# Altium schematic sheet SolderingStation_Power.SchDoc
size A4
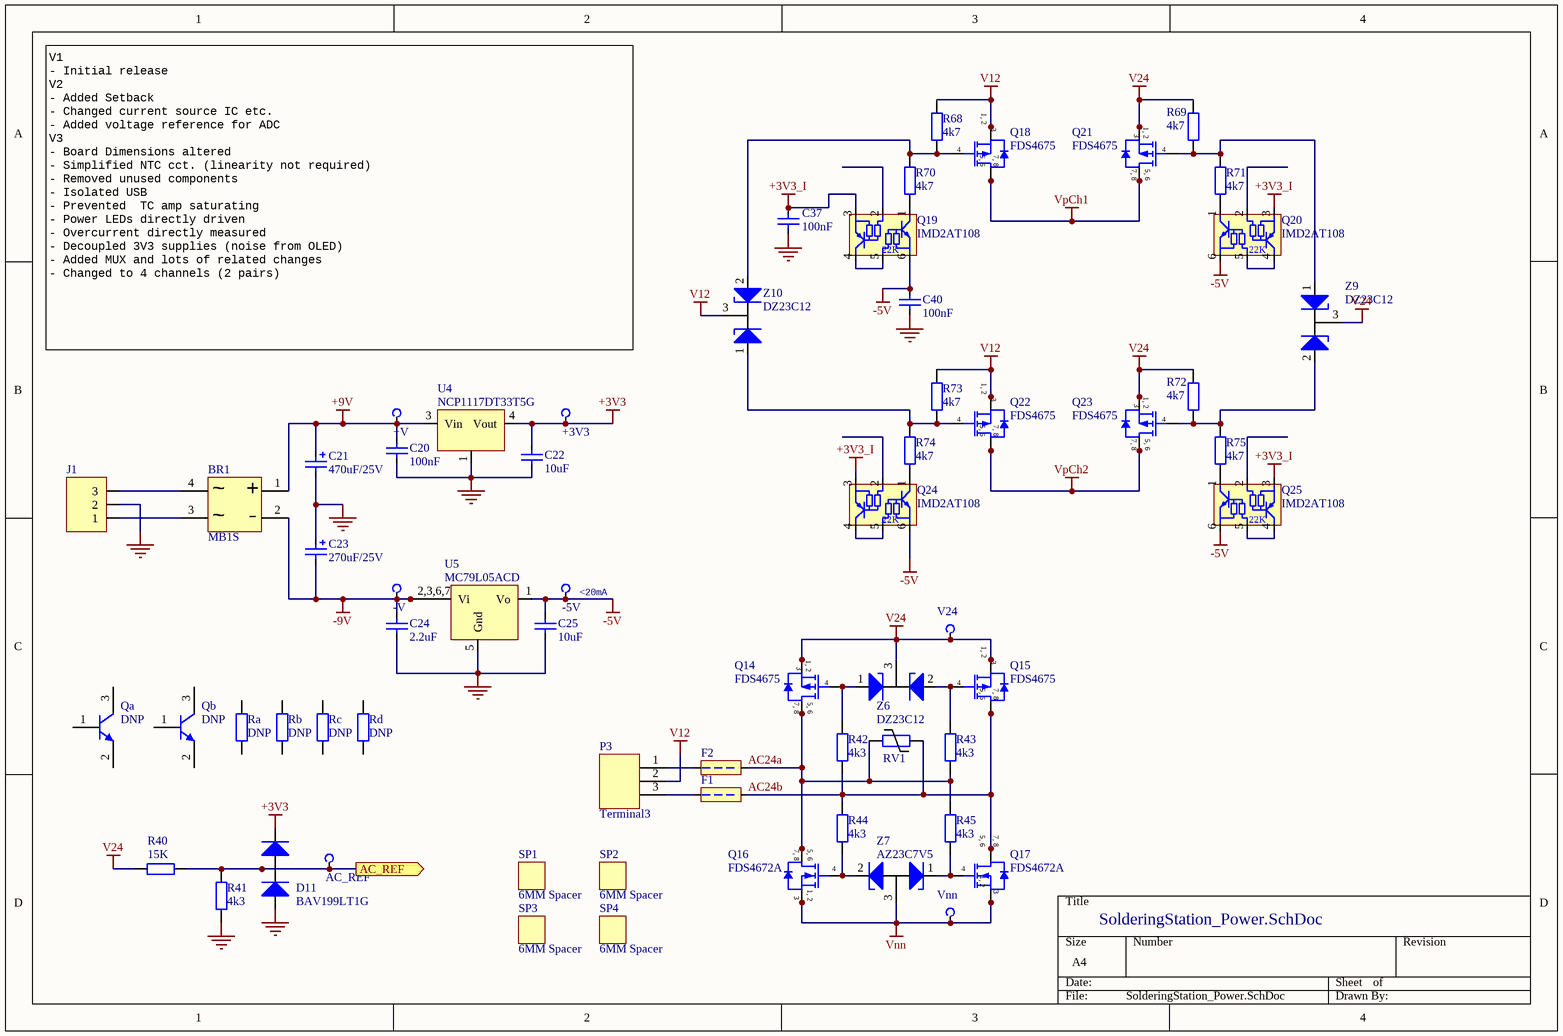
[diagram p0: SolderingStation_Power.SchDoc]

## Parts
+3V3  +3.3 volt  [PCBPIN - 0.7mm]  (value not drawn)  (no BOM)
+V  9 volt unregulated  [PCBPIN - 0.7mm]  (value not drawn)  (no BOM)
-5V  -5 volt  [PCBPIN - 0.7mm]  (value not drawn)  (no BOM)
-V  -9 volt unregulated  [PCBPIN - 0.7mm]  (value not drawn)  (no BOM)
AC_REF  Vdd  [PCBPIN - 0.7mm]  (value not drawn)  (no BOM)
BR1  MB1S  [MB1S]
C20  100nF  [CCNP2012-0805]
C21  470uF/25V  [RB5/10x13mm]
C22  10uF  [CCNP2012-0805]
C23  270uF/25V  [RB5/10x13mm]
C24  2.2uF  [CCNP2012-0805]
C25  10uF  [CCNP2012-0805]
C37  100nF  [CCNP1608-0603]
C40  100nF  [CCNP1608-0603]
D11  BAV199LT1G  [SOT23_M]
F1  Fuse-0680L9100-01  [CF6125-2410_M]  (value not drawn)
F2  Fuse-0680L9100-01  [CF6125-2410_M]  (value not drawn)
J1  JST XH Connector, 3-Pin  [jst-b3b-xh-ax]  (value not drawn)
P3  Terminal3  [MOLEX-39544-3003]
Q14  FDS4675  [SO-8_M]
Q15  FDS4675  [SO-8_M]
Q16  FDS4672A  [SO-8_M]
Q17  FDS4672A  [SO-8_M]
Q18  FDS4675  [SO-8_M]
Q19  IMD2AT108  [SOT457_N]
Q20  IMD2AT108  [SOT457_N]
Q21  FDS4675  [SO-8_M]
Q22  FDS4675  [SO-8_M]
Q23  FDS4675  [SO-8_M]
Q24  IMD2AT108  [SOT457_N]
Q25  IMD2AT108  [SOT457_N]
Qa  DNP  [SOT23_M]  (no BOM)
Qb  DNP  [SOT23_M]  (no BOM)
R40  15K  [CR1608-0603_N]
R41  4k3  [CR1608-0603_N]
R42  4k3  [CR1608-0603_N]
R43  4k3  [CR1608-0603_N]
R44  4k3  [CR1608-0603_N]
R45  4k3  [CR1608-0603_N]
R68  4k7  [CR1608-0603_N]
R69  4k7  [CR1608-0603_N]
R70  4k7  [CR1608-0603_N]
R71  4k7  [CR1608-0603_N]
R72  4k7  [CR1608-0603_N]
R73  4k7  [CR1608-0603_N]
R74  4k7  [CR1608-0603_N]
R75  4k7  [CR1608-0603_N]
Ra  DNP  [CR1608-0603_N]  (no BOM)
Rb  DNP  [CR1608-0603_N]  (no BOM)
Rc  DNP  [CR1608-0603_N]  (no BOM)
Rd  DNP  [CR1608-0603_N]  (no BOM)
RV1  V33MLA1206NHAUTO  [VR3216-1206]  (value not drawn)
SP1  6MM Spacer  [Spacer-2mm dia x 6mm]
SP2  6MM Spacer  [Spacer-2mm dia x 6mm]
SP3  6MM Spacer  [Spacer-2mm dia x 6mm]
SP4  6MM Spacer  [Spacer-2mm dia x 6mm]
U4  NCP1117DT33T5G  [TO-252]
U5  MC79L05ACD  [SOIC127P600-8N]
V24  Power +V  [PCBPIN - 0.7mm]  (value not drawn)  (no BOM)
Vnn  Power Ground  [PCBPIN - 0.7mm]  (value not drawn)  (no BOM)
Z6  DZ23C12  [SOT23_M]
Z7  AZ23C7V5  [SOT23_M]
Z9  DZ23C12  [SOT23_M]
Z10  DZ23C12  [SOT23_M]

## Ports
AC_REF (out)

## Nets
+3V3: +3V3.1(TP) C22.2 D11.2(A2) U4.4(Vout)
+3V3_I: C37.1 Q19.3(E2) Q20.3(E2) Q24.3(E2) Q25.3(E2)
+9V: +V.1(TP) BR1.1 C20.2 C21.1 U4.3(Vin)
-5V: -5V.1(TP) C25.2 C40.1 Q19.6(E1) Q20.6(E1) Q24.6(E1) Q25.6(E1) U5.1(Vo)
-9V: -V.1(TP) BR1.2 C23.2 C24.2 U5.2(Vi) U5.3(Vi) U5.6(Vi) U5.7(Vi)
GND: C20.1 C21.2 C22.1 C23.1 C24.1 C25.1 C37.2 C40.2 D11.1(A1) J1.2 R41.1 U4.1(Gnd) U5.5(Gnd)
V12: P3.2 Q18.1(S) Q18.2(S) Q18.3(S) Q22.1(S) Q22.2(S) Q22.3(S) R68.2 R73.2 Z10.3(K)
V24: Q14.1(S) Q14.2(S) Q14.3(S) Q15.1(S) Q15.2(S) Q15.3(S) Q21.1(S) Q21.2(S) Q21.3(S) Q23.1(S) Q23.2(S) Q23.3(S) R40.1 R69.2 R72.2 V24.1(TP) Z6.3(K) Z9.3(K)
Vnn: Q16.1(S) Q16.2(S) Q16.3(S) Q17.1(S) Q17.2(S) Q17.3(S) Vnn.1(TP) Z7.3(K)
VpCh1: Q18.5(D) Q18.6(D) Q18.7(D) Q18.8(D) Q21.5(D) Q21.6(D) Q21.7(D) Q21.8(D)
VpCh2: Q22.5(D) Q22.6(D) Q22.7(D) Q22.8(D) Q23.5(D) Q23.6(D) Q23.7(D) Q23.8(D)
AC24a: F2.2 Q14.5(D) Q14.6(D) Q14.7(D) Q14.8(D) Q16.5(D) Q16.6(D) Q16.7(D) Q16.8(D) R43.1 R45.2 RV1.2
AC24b: F1.2 Q15.5(D) Q15.6(D) Q15.7(D) Q15.8(D) Q17.5(D) Q17.6(D) Q17.7(D) Q17.8(D) R42.1 R44.2 RV1.1
AC_REF: AC_REF.1(TP) D11.3(K) R40.2 R41.2 ; port AC_REF
NetBR1_3: BR1.3 J1.1
NetBR1_4: BR1.4 J1.3
NetF1_1: F1.1 P3.3
NetF2_1: F2.1 P3.1
NetQ14_4: Q14.4(G) R42.2 Z6.1(A1)
NetQ15_4: Q15.4(G) R43.2 Z6.2(A2)
NetQ16_4: Q16.4(G) R44.1 Z7.2(A2)
NetQ17_4: Q17.4(G) R45.1 Z7.1(A1)
NetQ18_4: Q18.4(G) R68.1 R70.2 Z10.2(A2)
NetQ19_1: Q19.1(C1) R70.1
NetQ19_4: Q19.4(C2) Q19.5(B1)
NetQ20_1: Q20.1(C1) R71.1
NetQ20_4: Q20.4(C2) Q20.5(B1)
NetQ21_4: Q21.4(G) R69.1 R71.2 Z9.1(A1)
NetQ22_4: Q22.4(G) R73.1 R74.2 Z10.1(A1)
NetQ23_4: Q23.4(G) R72.1 R75.2 Z9.2(A2)
NetQ24_1: Q24.1(C1) R74.1
NetQ24_4: Q24.4(C2) Q24.5(B1)
NetQ25_1: Q25.1(C1) R75.1
NetQ25_4: Q25.4(C2) Q25.5(B1)

Not connected (* = marked no-connect by the designer): Q19 2(B2); Q20 2(B2); Q24 2(B2); Q25 2(B2); Qa 1(B) 2(E) 3(C); Qb 1(B) 2(E) 3(C); Ra 1 2; Rb 1 2; Rc 1 2; Rd 1 2; U5 4(NC) 8(NC)

## Notes on the sheet
- V1
  - Initial release
  V2
  - Added Setback
  - Changed current source IC etc.
  - Added voltage reference for ADC
  V3
  - Board Dimensions altered
  - Simplified NTC cct. (linearity not required)
  - Removed unused components
  - Isolated USB
  - Prevented  TC amp saturating
  - Power LEDs directly driven
  - Overcurrent directly measured
  - Decoupled 3V3 supplies (noise from OLED)
  - Added MUX and lots of related changes
  - Changed to 4 channels (2 pairs)
- (near -5V) <20mA
- (in symbol FDS4672A) 7, 8; 5, 6; 1, 2
- (in symbol FDS4675) 1, 2; 7, 8; 5, 6
- (in symbol IMD2AT108) 22K
- (in symbol MB1S) ~; +; -
- (in symbol MC79L05ACD) 2,3,6,7

## Library data of the parts
+3V3 +V -5V -V AC_REF V24 Vnn = TP: Test Point; Digikey: *; Farnell PN: *; LCSC: *
BR1 = MB1S: Bridge Rectifier Diode, Single Phase, 100 V, 800 mA, SOIC, 1.1 V, 4 Pins; LCSC: C232821
C20 C24 = Cap_CCNP_0805: Capacitor non-polar SMT 0805; Manufacturer: Generic Components; Class: Passive; Published: 08/06/2000; Publisher: Altium Hobart Technology Centre; SubClass: Capacitor; Farnell PN: *; Digikey: *
  C20: LCSC: C49678; Value: 100nF
  C24: LCSC: C49217; Value: 2.2uF
C21 C23 = Cap-RB5/10x16MM
  C21: value: 470uF/25V
  C23: value: 270uF/25V
C22 C25 = Cap: Capacitor; Manufacturer: Generic Components; Class: Passive; Published: 08/06/2000; Publisher: Altium Hobart Technology Centre; SubClass: Capacitor; Farnell PN: *; Digikey: *; Value: 10uF; LCSC: C15850
C37 C40 = Cap_CCNP_0603: Capacitor non-polar SMT 0603; Manufacturer: Generic Components; Class: Passive; Published: 08/06/2000; Publisher: Altium Hobart Technology Centre; SubClass: Capacitor; Farnell PN: *; Digikey: *; Value: 100nF; LCSC: C14663
D11 = BAV199LT1G: Dual Series low-leakage switching diodes, 3-Pin SOT-23; Digikey: BAV199LT1GOSCT-ND; Farnell PN: 1431115; LCSC: C145516
F1 F2 = Fuse-0680L9100-01: Fuse, Surface Mount, 10 A, Slow Blow, 50 VAC, 75 VDC, 2410 (6125 Metric), 0680L Series; Value: 10 A; Digikey: 507-1415-ND
J1 = JST-B3B-XH-A: LatestRevisionDate: 17-Jul-2002; LatestRevisionNote: Re-released for DXP Platform.; Publisher: Altium Limited; LCSC: *; Farnell PN: 1516277; Digikey: 455-2248-ND
P3 = Terminal3: MULTICOMP MC24367 Wire-To-Board Terminal Block; Farnell PN: *; LCSC: *
Q14 Q15 Q18 Q21-Q23 = FDS4675: P-Channel Power MOSFET, 11 A, 40 V, RDS(ON) = 0.013 ohm @ VGS = -10   VRDS(ON) = 0.017 ohm @ VGS =   -4.5 VC; Manufacturer: Fairchild Semiconductor; Package Version: Rev. 16, 08/2015; Qg Gate Charge: 56nC; Drain-to-Source Voltage [Vdss]: 40V; Drain-Source On Resistance-Max: 13mO; Rated Power Dissipation: 2.4W; Datasheet Version: Rev. C(W), 02/2001; Package Description: 8-Pin Small Outline Integrated Circuit, Body 4.9 x 3.9 mm, Pitch 1.27 mm; Channel Type: P-Channel; Datasheet URL: https://www.fairchildsemi.com/datasheets/FD/FDS4675.pdf; Package URL: https://www.fairchildsemi.com/package-drawings/M0/M08A.pdf; Package Reference: SO-8; Mounting Technology: SurfaceMount; Manufacturer URL: https://www.fairchildsemi.com/; Temperature: 25
Q16 Q17 = FDS4672A: N-Channel Power MOSFET, 11 A, 40 V. RDS(ON)  = .013 ohm @ VGS = 4.5 V; Manufacturer: Fairchild Semiconductor; Package Version: Rev. 16, 08/2015; Channel Type: P-Channel; Qg Gate Charge: 56nC; Drain-to-Source Voltage [Vdss]: 40V; Drain-Source On Resistance-Max: 13mO; Rated Power Dissipation: 2.4W; Datasheet Version: Rev. C(W), 02/2001; Package Description: 8-Pin Small Outline Integrated Circuit, Body 4.9 x 3.9 mm, Pitch 1.27 mm; Datasheet URL: https://www.fairchildsemi.com/datasheets/FD/FDS4675.pdf; Package URL: https://www.fairchildsemi.com/package-drawings/M0/M08A.pdf; Package Reference: SO-8; Mounting Technology: SurfaceMount; Manufacturer URL: https://www.fairchildsemi.com/; LCSC: C725034
Q19 Q20 Q24 Q25 = IMD2AT108: Pre-Biased NPN and PNP pair, 50 V, 100 mA, 22 kohm, 22 kohm; Farnell PN: 1680329
Qa Qb = MMBT3904LT1G: SOT23; ComponentLink2Description: Datasheet; ComponentLink2URL: http://www.onsemi.cn/pub_link/Collateral/MMBT3904LT1-D.PDF; ComponentLink1URL: http://www.onsemi.com/; ComponentLink3Description: Package Specification; ComponentLink1Description: Manufacturer URL; ComponentLink3URL: http://www.onsemi.cn/pub_link/Collateral/318-08.PDF
R40-R45 R68-R75 Ra Rb Rc Rd = Res_CR0603: Resistor SMT 0603; Manufacturer: Generic Components; Class: Passive; Published: 08/06/2000; Publisher: Altium Hobart Technology Centre; SubClass: Resistor; Farnell PN: *; Digikey: *
  R40: LCSC: C22809; Value: 15K
  R41-R45: LCSC: C23159; Value: 4k3
  R68-R75: LCSC: C23162; Value: 4k7
  Ra Rb Rc Rd: Value: DNP
RV1 = V33MLA1206NHAUTO: V33MLA1206NH - TVS Varistor, 26 V, 33 V, MLA Series, 75 V, 1206 [3216 Metric], Multilayer Varistor (MLV); Manufacturer: Generic Components; Class: Passive; SubClass: Resistor; Published: 08/06/2000; Publisher: Altium Hobart Technology Centre; Farnell PN: 1816942; Digikey: F11298CT-ND; LCSC: *
SP1-SP4 = Spacer-6mm
U4 = NCP1117DT33T5G: IC REG LINEAR +3V3 1A TO252-3; Farnel: 2464254; DigiKey: NCP1117DT33T5GOSCT-ND; LCSC: C152529
U5 = MC79L05ACD: IC REG LINEAR -5V 100MA SOIC-8; DigiKey: UA79M05CKVURG3; LCSC: C154823; Farnell PN: 3122804
Z6 Z9 Z10 = DZ23Cxx: Dual silicon planar Zener diodes; Digikey: *; Farnell PN: *; LCSC: *
Z7 = AZ23Cxx: Dual silicon planar Zener diodes; Digikey: *; Farnell PN: *; LCSC: *